# EAGLE schematic Esquema (EAGLE 9.6.2)
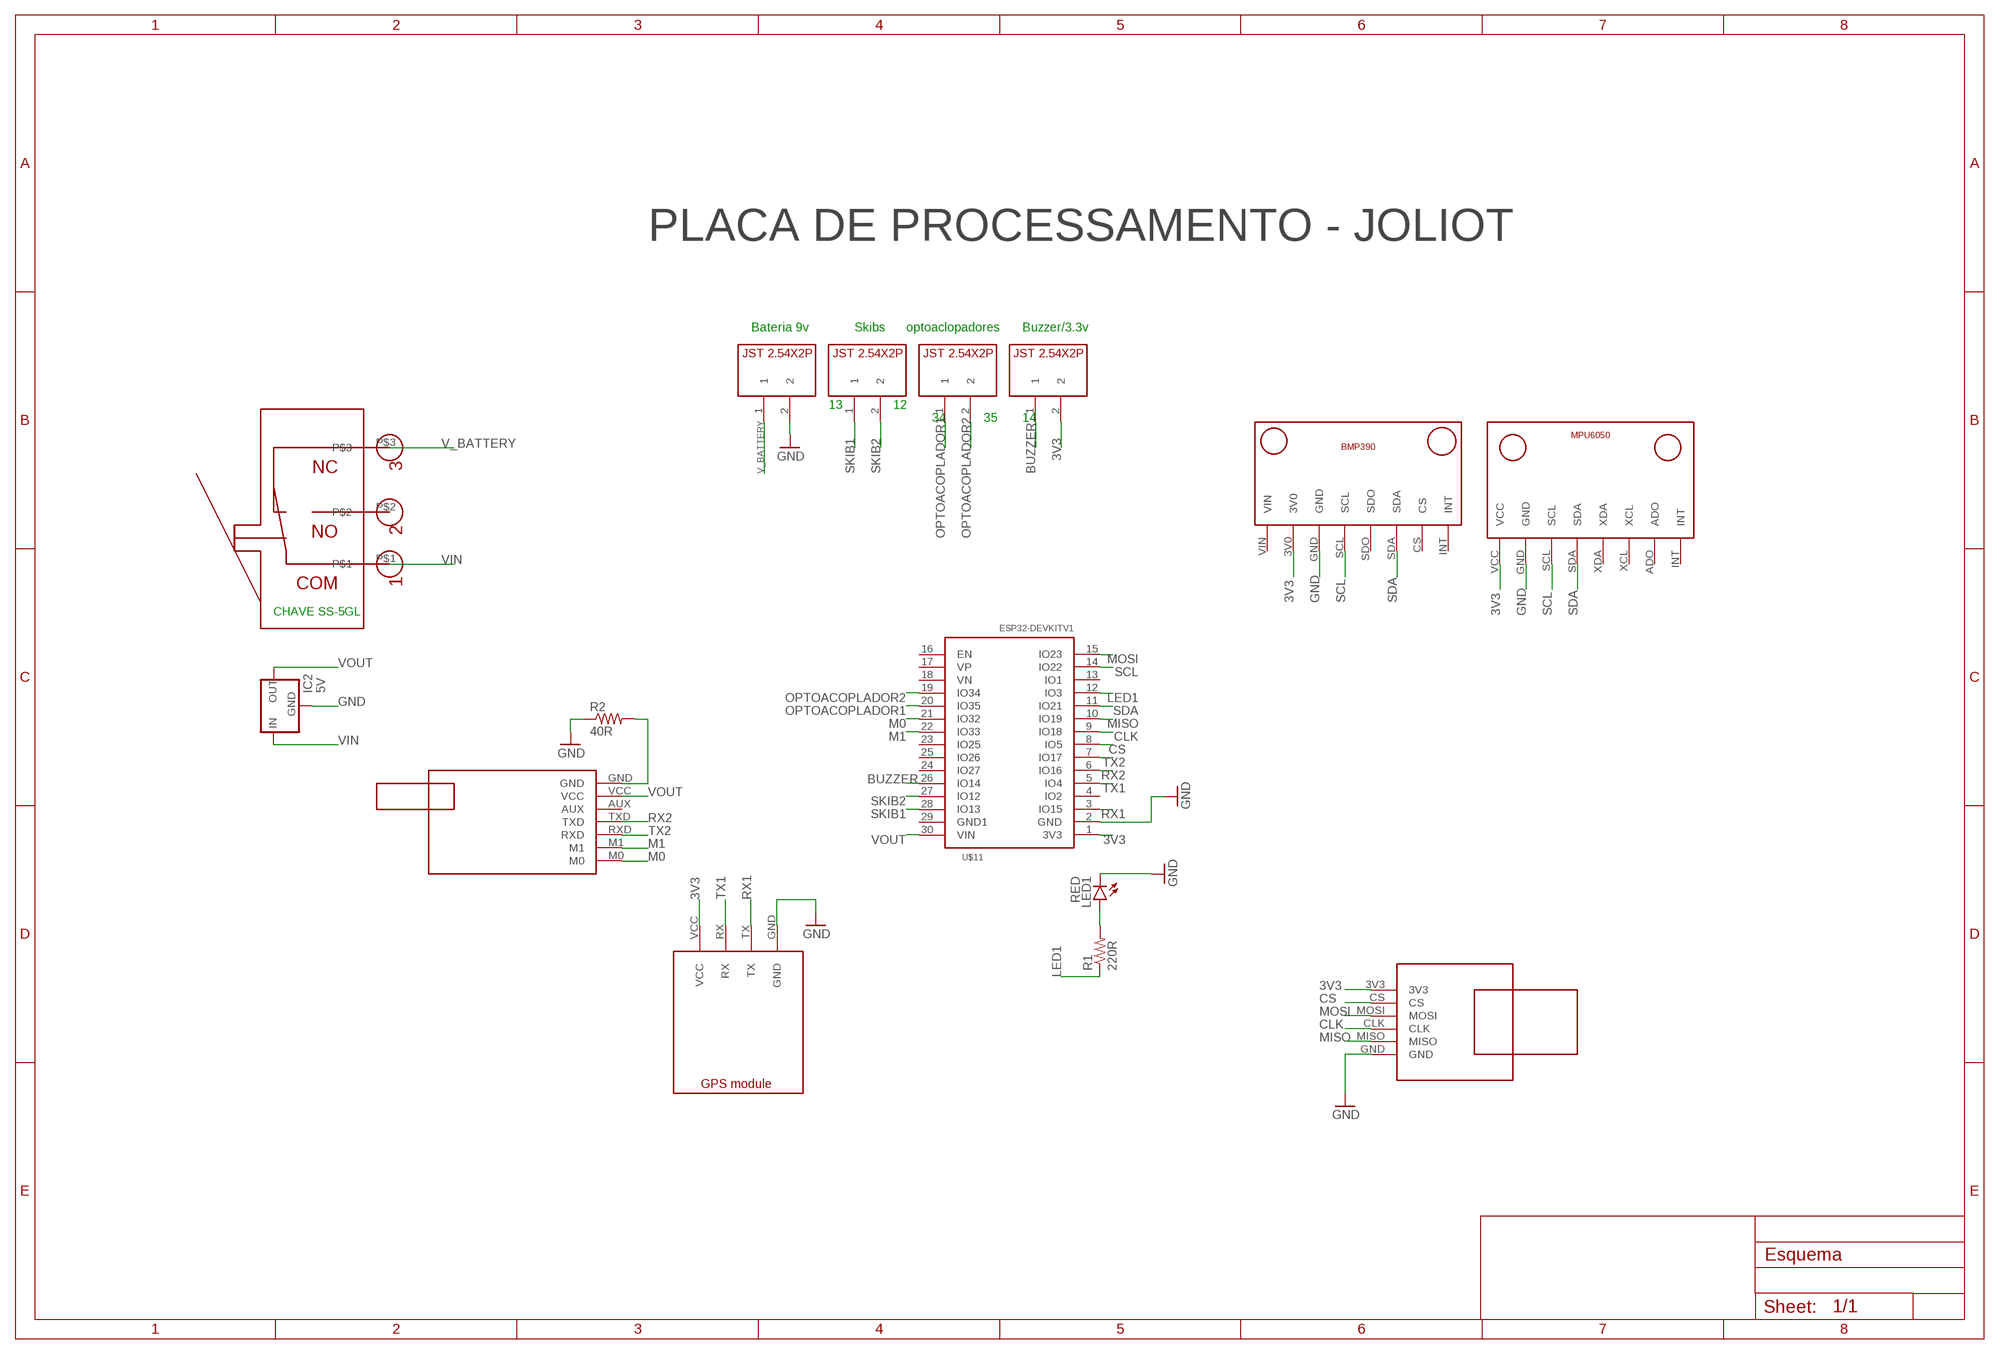
[diagram p0: schematic, sheet 1]

## Parts
IC2  5V  78XXL  [78XXL]
LED1  RED  LED5MM  [LED5MM]
R1  220R  R-US_0309/12  [0309/12]
R2  40R  R-US_0309/12  [0309/12]
U$1  BMP390V1  [BMP390_FOOTPRINT]
U$2  E22-400T30D  [E22-400T30D_FOOTPRINT]
U$3  GPS_MODULE  [GPS_MODULE_FOOTPRINT]
U$4  JST2.54X2P  [JST2.54X2P_FOOTPRINT]
U$5  JST2.54X2P  [JST2.54X2P_FOOTPRINT]
U$6  JST2.54X2P  [JST2.54X2P_FOOTPRINT]
U$7  JST2.54X2P  [JST2.54X2P_FOOTPRINT]
U$8  MICROSD_SMALL_READER  [MICROSD_SMALL_READER_FOOTPRINT]
U$9  MPU6050V1  [MPU6050_FOOTPRINT]
U$11  ESP32DEVKITV1  [ESP32-DEVKITV1]
U$12  CHAVE_SS-5GL  [CHAVESS-5GL]

## Nets
3V3: U$1.3V0 U$3.VCC U$4.2 U$8.3V3 U$9.VCC U$11.1(3V3)
BUZZER: U$4.1 U$11.26(IO14)
CLK: U$8.CLK U$11.9(IO18)
CS: U$8.CS U$11.8(IO5)
GND: IC2.GND LED1.K(C) R2.1 U$1.GND U$3.GND U$7.2 U$8.GND U$9.GND U$11.2(GND)
LED1: R1.1 U$11.12(IO3)
M0: U$2.M0 U$11.21(IO32)
M1: U$2.M1 U$11.22(IO33)
MISO: U$8.MISO U$11.10(IO19)
MOSI: U$8.MOSI U$11.15(IO23)
N$4: LED1.A R1.2
N$7: R2.2 U$2.GND
OPTOACOPLADOR1: U$5.1 U$11.20(IO35)
OPTOACOPLADOR2: U$5.2 U$11.19(IO34)
RX1: U$3.TX U$11.3(IO15)
RX2: U$2.TXD U$11.6(IO16)
SCL: U$1.SCL U$9.SCL U$11.14(IO22)
SDA: U$1.SDA U$9.SDA U$11.11(IO21)
SKIB1: U$6.1 U$11.28(IO13)
SKIB2: U$6.2 U$11.27(IO12)
TX1: U$3.RX U$11.5(IO4)
TX2: U$2.RXD U$11.7(IO17)
V_BATTERY: U$7.1 U$12.P$3
VIN: IC2.IN U$12.P$1
VOUT: IC2.OUT U$2.VCC U$11.30(VIN)
Unconnected: U$1.CS U$1.INT U$1.SDO U$1.VIN U$2.AUX U$9.ADO U$9.INT U$9.XCL U$9.XDA U$11.4(IO2) U$11.13(IO1) U$11.16(EN) U$11.17(VP) U$11.18(VN) U$11.23(IO25) U$11.24(IO27) U$11.25(IO26) U$11.29(GND1) U$12.P$2

## Notes on the sheet
- PLACA DE PROCESSAMENTO - JOLIOT
- Bateria 9v | Skibs | optoaclopadores | Buzzer/3.3v
- 13 | 12
- 34 | 35 | 14

## Library data of the parts
IC2 = v-reg:78XXL: VOLTAGE REGULATOR
LED1 = led:LED: LED OSRAM: - CHIPLED LG R971, LG N971, LY N971, LG Q971, LY Q971, LO R971, LY R971 LH N974, LH R974 LS Q976, LO Q976, LY Q976 LO Q996 - Hyper CHIPLED LW Q18S LB Q993, LB Q99A, LB R99A - SideLED LS A670, LO A670, LY A670, LG A670, LP A670 LB A673, LV A673, LT A673, LW A673 LH A674 LY A675 LS A676, LA A676, LO A676, LY A676, LW A676 LS A679, LY A679, LG A679 - Hyper Micro SIDELED® LS Y876, LA Y876, LO Y876, LY Y876 LT Y87S - SmartLED LW L88C, LW L88S LB L89C, LB L89S, LG L890 LS L89K, LO L89K, LY L89K LS L896, LA L896, LO L896, LY L896 - TOPLED LS T670, LO T670, LY T670, LG T670, LP T670 LSG T670, LSP T670, LSY T670, LOP T670, LYG T670 LG T671, LOG T671, LSG T671 LB T673, LV T673, LT T673, LW T673 LH T674 LS T676, LA T676, LO T676, LY T676, LB T676, LH T676, LSB T676, LW T676 LB T67C, LV T67C, LT T67C, LS T67K, LO T67K, LY T67K, LW E67C LS E67B, LA E67B, LO E67B, LY E67B, LB E67C, LV E67C, LT E67C LW T67C LS T679, LY T679, LG T679 LS T770, LO T770, LY T770, LG T770, LP T770 LB T773, LV T773, LT T773, LW T773 LH T774 LS E675, LA E675, LY E675, LS T675 LS T776, LA T776, LO T776, LY T776, LB T776 LHGB T686 LT T68C, LB T68C - Hyper Mini TOPLED® LB M676 - Mini TOPLED Santana® LG M470 LS M47K, LO M47K, LY M47K Source: http://www.osram.convergy.de LUXEON: - LUMILED® LXK2-PW12-R00, LXK2-PW12-S00, LXK2-PW14-U00, LXK2-PW14-V00 LXK2-PM12-R00, LXK2-PM12-S00, LXK2-PM14-U00 LXK2-PE12-Q00, LXK2-PE12-R00, LXK2-PE12-S00, LXK2-PE14-T00, LXK2-PE14-U00 LXK2-PB12-K00, LXK2-PB12-L00, LXK2-PB12-M00, LXK2-PB14-N00, LXK2-PB14-P00, LXK2-PB14-Q00 LXK2-PR12-L00, LXK2-PR12-M00, LXK2-PR14-Q00, LXK2-PR14-R00 LXK2-PD12-Q00, LXK2-PD12-R00, LXK2-PD12-S00 LXK2-PH12-R00, LXK2-PH12-S00 LXK2-PL12-P00, LXK2-PL12-Q00, LXK2-PL12-R00 Source: www.luxeon.com KINGBRIGHT: KA-3528ASYC Source: www.kingbright.com
R1 R2 = rcl:R-US_: RESISTOR, American symbol; SPICEPREFIX: R
U$1 = CRD:BMP390: Sensor barométrico
U$2 = CRD:E22-400T30D
U$3 = CRD:GPS_MODULE
U$4-U$7 = CRD:JST2.54X2P: Conector JST 2 pinos (2.54mm de distância entre pinos)
U$8 = CRD:MICROSD_SMALL_READER
U$9 = CRD:MPU6050: Acelerômetro e Giroscópio
U$11 = ESP32-DEVKITV1:ESP32DEVKITV1
U$12 = CRD:CHAVE_SS-5GL